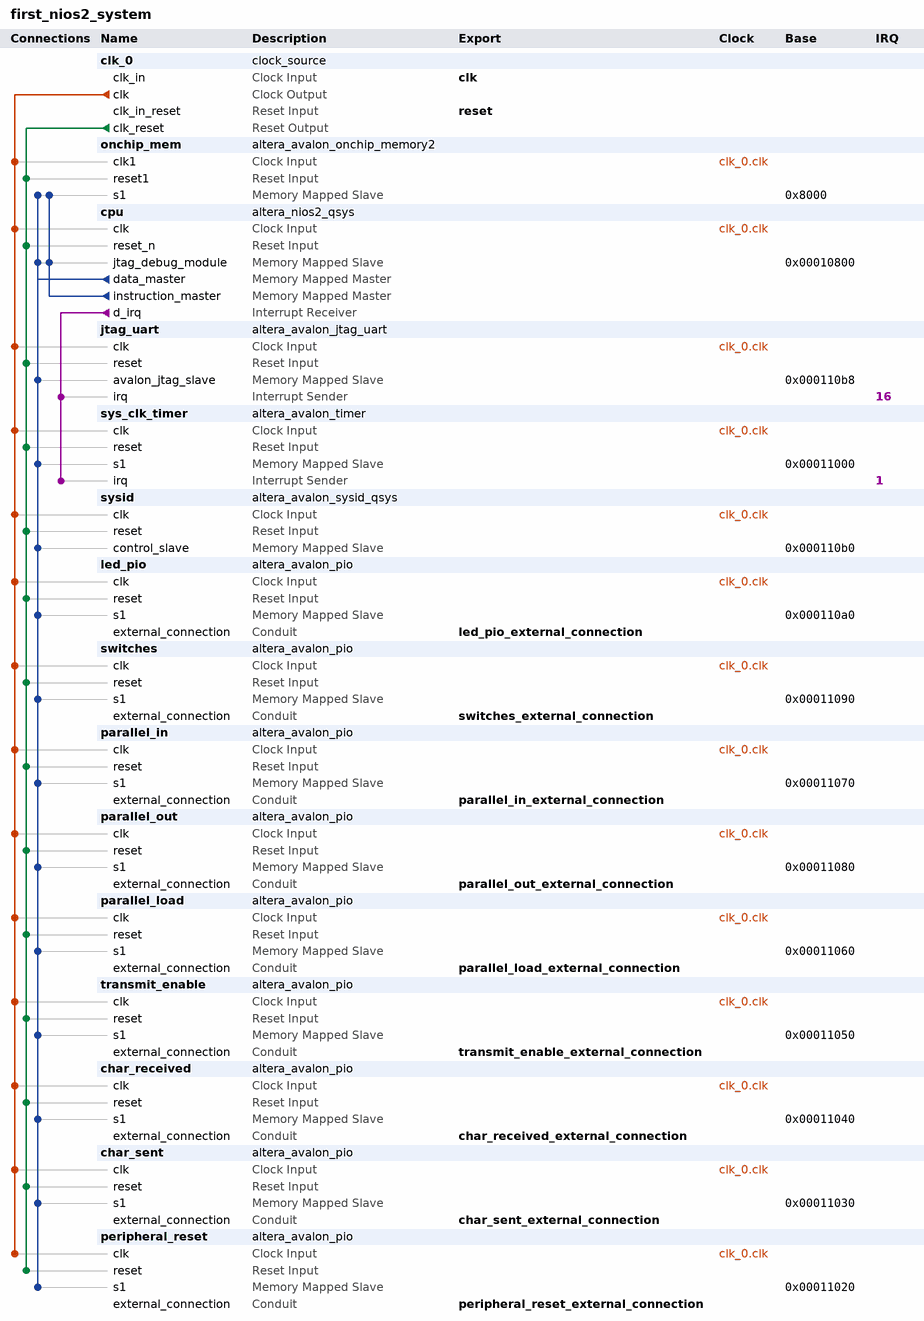
[diagram p0: system contents]
# Platform Designer (Qsys) system first_nios2_system, Cyclone V 5CSEMA5F31C6
# Parameters at their usual value, and those the tool derives, are not listed.
package require -exact qsys 16.0
create_system first_nios2_system
set_project_property DEVICE_FAMILY {Cyclone V}
set_project_property DEVICE 5CSEMA5F31C6

add_instance clk_0 clock_source 16.0
set_instance_parameter_value clk_0 clockFrequency 50000000

add_instance onchip_mem altera_avalon_onchip_memory2 16.0
set_instance_parameter_value onchip_mem dataWidth 32
set_instance_parameter_value onchip_mem dualPort false
set_instance_parameter_value onchip_mem initMemContent true
set_instance_parameter_value onchip_mem initializationFileName onchip_mem.hex
set_instance_parameter_value onchip_mem memorySize 20480

add_instance cpu altera_nios2_qsys 16.0
set_instance_parameter_value cpu breakSlave cpu.jtag_debug_module
set_instance_parameter_value cpu exceptionSlave onchip_mem.s1
set_instance_parameter_value cpu icache_size 2048
set_instance_parameter_value cpu impl Small
set_instance_parameter_value cpu mmu_TLBMissExcSlave None
set_instance_parameter_value cpu muldiv_multiplierType NoneSmall
set_instance_parameter_value cpu resetSlave onchip_mem.s1
set_instance_parameter_value cpu resetrequest_enabled true

add_instance jtag_uart altera_avalon_jtag_uart 16.0
set_instance_parameter_value jtag_uart simInteractiveOptions NO_INTERACTIVE_WINDOWS

add_instance sys_clk_timer altera_avalon_timer 16.0
set_instance_parameter_value sys_clk_timer period 1
set_instance_parameter_value sys_clk_timer periodUnits MSEC

add_instance sysid altera_avalon_sysid_qsys 16.0
set_instance_parameter_value sysid id 0

add_instance led_pio altera_avalon_pio 16.0
set_instance_parameter_value led_pio direction Output
set_instance_parameter_value led_pio width 8

add_instance switches altera_avalon_pio 16.0
set_instance_parameter_value switches direction Input
set_instance_parameter_value switches width 8

add_instance parallel_in altera_avalon_pio 16.0
set_instance_parameter_value parallel_in direction Input
set_instance_parameter_value parallel_in width 8

add_instance parallel_out altera_avalon_pio 16.0
set_instance_parameter_value parallel_out direction Output
set_instance_parameter_value parallel_out width 8

add_instance parallel_load altera_avalon_pio 16.0
set_instance_parameter_value parallel_load direction Output
set_instance_parameter_value parallel_load width 1

add_instance transmit_enable altera_avalon_pio 16.0
set_instance_parameter_value transmit_enable direction Output
set_instance_parameter_value transmit_enable width 1

add_instance char_received altera_avalon_pio 16.0
set_instance_parameter_value char_received direction Input
set_instance_parameter_value char_received width 1

add_instance char_sent altera_avalon_pio 16.0
set_instance_parameter_value char_sent direction Input
set_instance_parameter_value char_sent width 1

add_instance peripheral_reset altera_avalon_pio 16.0
set_instance_parameter_value peripheral_reset direction Output
set_instance_parameter_value peripheral_reset width 1

# connections
add_connection clk_0.clk char_received.clk clock
add_connection clk_0.clk char_sent.clk clock
add_connection clk_0.clk cpu.clk clock
add_connection clk_0.clk jtag_uart.clk clock
add_connection clk_0.clk led_pio.clk clock
add_connection clk_0.clk onchip_mem.clk1 clock
add_connection clk_0.clk parallel_in.clk clock
add_connection clk_0.clk parallel_load.clk clock
add_connection clk_0.clk parallel_out.clk clock
add_connection clk_0.clk peripheral_reset.clk clock
add_connection clk_0.clk switches.clk clock
add_connection clk_0.clk sys_clk_timer.clk clock
add_connection clk_0.clk sysid.clk clock
add_connection clk_0.clk transmit_enable.clk clock
add_connection clk_0.clk_reset char_received.reset reset
add_connection clk_0.clk_reset char_sent.reset reset
add_connection clk_0.clk_reset cpu.reset_n reset
add_connection clk_0.clk_reset jtag_uart.reset reset
add_connection clk_0.clk_reset led_pio.reset reset
add_connection clk_0.clk_reset onchip_mem.reset1 reset
add_connection clk_0.clk_reset parallel_in.reset reset
add_connection clk_0.clk_reset parallel_load.reset reset
add_connection clk_0.clk_reset parallel_out.reset reset
add_connection clk_0.clk_reset peripheral_reset.reset reset
add_connection clk_0.clk_reset switches.reset reset
add_connection clk_0.clk_reset sys_clk_timer.reset reset
add_connection clk_0.clk_reset sysid.reset reset
add_connection clk_0.clk_reset transmit_enable.reset reset
add_connection cpu.data_master char_received.s1 avalon
set_connection_parameter_value cpu.data_master/char_received.s1 baseAddress 0x00011040
add_connection cpu.data_master char_sent.s1 avalon
set_connection_parameter_value cpu.data_master/char_sent.s1 baseAddress 0x00011030
add_connection cpu.data_master cpu.jtag_debug_module avalon
set_connection_parameter_value cpu.data_master/cpu.jtag_debug_module baseAddress 0x00010800
add_connection cpu.data_master jtag_uart.avalon_jtag_slave avalon
set_connection_parameter_value cpu.data_master/jtag_uart.avalon_jtag_slave baseAddress 0x000110b8
add_connection cpu.data_master led_pio.s1 avalon
set_connection_parameter_value cpu.data_master/led_pio.s1 baseAddress 0x000110a0
add_connection cpu.data_master onchip_mem.s1 avalon
set_connection_parameter_value cpu.data_master/onchip_mem.s1 baseAddress 0x8000
add_connection cpu.data_master parallel_in.s1 avalon
set_connection_parameter_value cpu.data_master/parallel_in.s1 baseAddress 0x00011070
add_connection cpu.data_master parallel_load.s1 avalon
set_connection_parameter_value cpu.data_master/parallel_load.s1 baseAddress 0x00011060
add_connection cpu.data_master parallel_out.s1 avalon
set_connection_parameter_value cpu.data_master/parallel_out.s1 baseAddress 0x00011080
add_connection cpu.data_master peripheral_reset.s1 avalon
set_connection_parameter_value cpu.data_master/peripheral_reset.s1 baseAddress 0x00011020
add_connection cpu.data_master switches.s1 avalon
set_connection_parameter_value cpu.data_master/switches.s1 baseAddress 0x00011090
add_connection cpu.data_master sys_clk_timer.s1 avalon
set_connection_parameter_value cpu.data_master/sys_clk_timer.s1 baseAddress 0x00011000
add_connection cpu.data_master sysid.control_slave avalon
set_connection_parameter_value cpu.data_master/sysid.control_slave baseAddress 0x000110b0
add_connection cpu.data_master transmit_enable.s1 avalon
set_connection_parameter_value cpu.data_master/transmit_enable.s1 baseAddress 0x00011050
add_connection cpu.instruction_master cpu.jtag_debug_module avalon
set_connection_parameter_value cpu.instruction_master/cpu.jtag_debug_module baseAddress 0x00010800
add_connection cpu.instruction_master onchip_mem.s1 avalon
set_connection_parameter_value cpu.instruction_master/onchip_mem.s1 baseAddress 0x8000
add_connection cpu.d_irq jtag_uart.irq interrupt
set_connection_parameter_value cpu.d_irq/jtag_uart.irq irqNumber 16
add_connection cpu.d_irq sys_clk_timer.irq interrupt
set_connection_parameter_value cpu.d_irq/sys_clk_timer.irq irqNumber 1

# exported interfaces
add_interface char_received_external_connection conduit end
set_interface_property char_received_external_connection EXPORT_OF char_received.external_connection
add_interface char_sent_external_connection conduit end
set_interface_property char_sent_external_connection EXPORT_OF char_sent.external_connection
add_interface clk clock sink
set_interface_property clk EXPORT_OF clk_0.clk_in
add_interface led_pio_external_connection conduit end
set_interface_property led_pio_external_connection EXPORT_OF led_pio.external_connection
add_interface parallel_in_external_connection conduit end
set_interface_property parallel_in_external_connection EXPORT_OF parallel_in.external_connection
add_interface parallel_load_external_connection conduit end
set_interface_property parallel_load_external_connection EXPORT_OF parallel_load.external_connection
add_interface parallel_out_external_connection conduit end
set_interface_property parallel_out_external_connection EXPORT_OF parallel_out.external_connection
add_interface peripheral_reset_external_connection conduit end
set_interface_property peripheral_reset_external_connection EXPORT_OF peripheral_reset.external_connection
add_interface reset reset sink
set_interface_property reset EXPORT_OF clk_0.clk_in_reset
add_interface switches_external_connection conduit end
set_interface_property switches_external_connection EXPORT_OF switches.external_connection
add_interface transmit_enable_external_connection conduit end
set_interface_property transmit_enable_external_connection EXPORT_OF transmit_enable.external_connection

set_interconnect_requirement {$system} qsys_mm.clockCrossingAdapter HANDSHAKE
set_interconnect_requirement {$system} qsys_mm.enableEccProtection FALSE
set_interconnect_requirement {$system} qsys_mm.insertDefaultSlave FALSE
set_interconnect_requirement {$system} qsys_mm.maxAdditionalLatency 1

save_system first_nios2_system.qsys
